# Altium schematic sheet connectors.SchDoc
size A
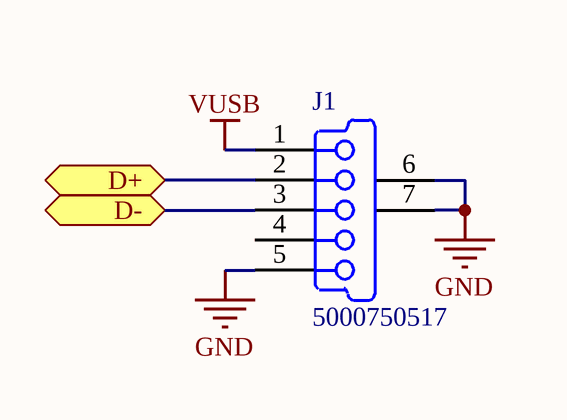
[diagram p0: connectors.SchDoc]

## Parts
J1  5000750517  [5000750517]

## Ports
D+ (bidir), D- (bidir)

## Nets
GND: J1.5(GND) J1.6(MH1) J1.7(MH2)
VUSB: J1.1(V_BUS)
D+: J1.2(D-) ; port D+
D-: J1.3(D+) ; port D-

Not connected (* = marked no-connect by the designer): J1 4(ID)

## Library data of the parts
J1 = 5000750517: USB On-The-Go (OTG) Mini-B Receptacle, Right Angle, Thru-Hole, 0.80mm (.031") Pitch, Solder Tails & Shell Tabs with Dimples; PCB_Layout: Complies with Manufacturer's Recommendation.; Published: 30-May-2008; DatasheetVersion: rev0, Mar-2004; PackageVersion: rev0, Mar-2004; PackageReference: 5000750517; Publisher: Altium Limited; PackageDescription: USB Mini-B, Type 2, Thru-Hole; 5 Position; Vertical, Body 7.7 x 4.2 x 7.7 mm (LxWxH); ComponentLink1Description: Manufacturer Link; ComponentLink1URL: http://www.molex.com/; ComponentLink2Description: Datasheet; ComponentLink2URL: http://www.molex.com/pdm_docs/sd/5000750517_sd.pdf